# EasyEDA Pro project 立创地文星CW32F030C8T6开发板.epro

# Schematic F030
Board Name: CW32F030C8T6; Create Date: 2024-04-28; Page Name: P1; Project Name: 【CW32】开发板; Schematic Name: F030; Update Date: 2024-05-09; Company: 嘉立创EDA; Page Size: A4; Reviewed: 嘉立创EDA
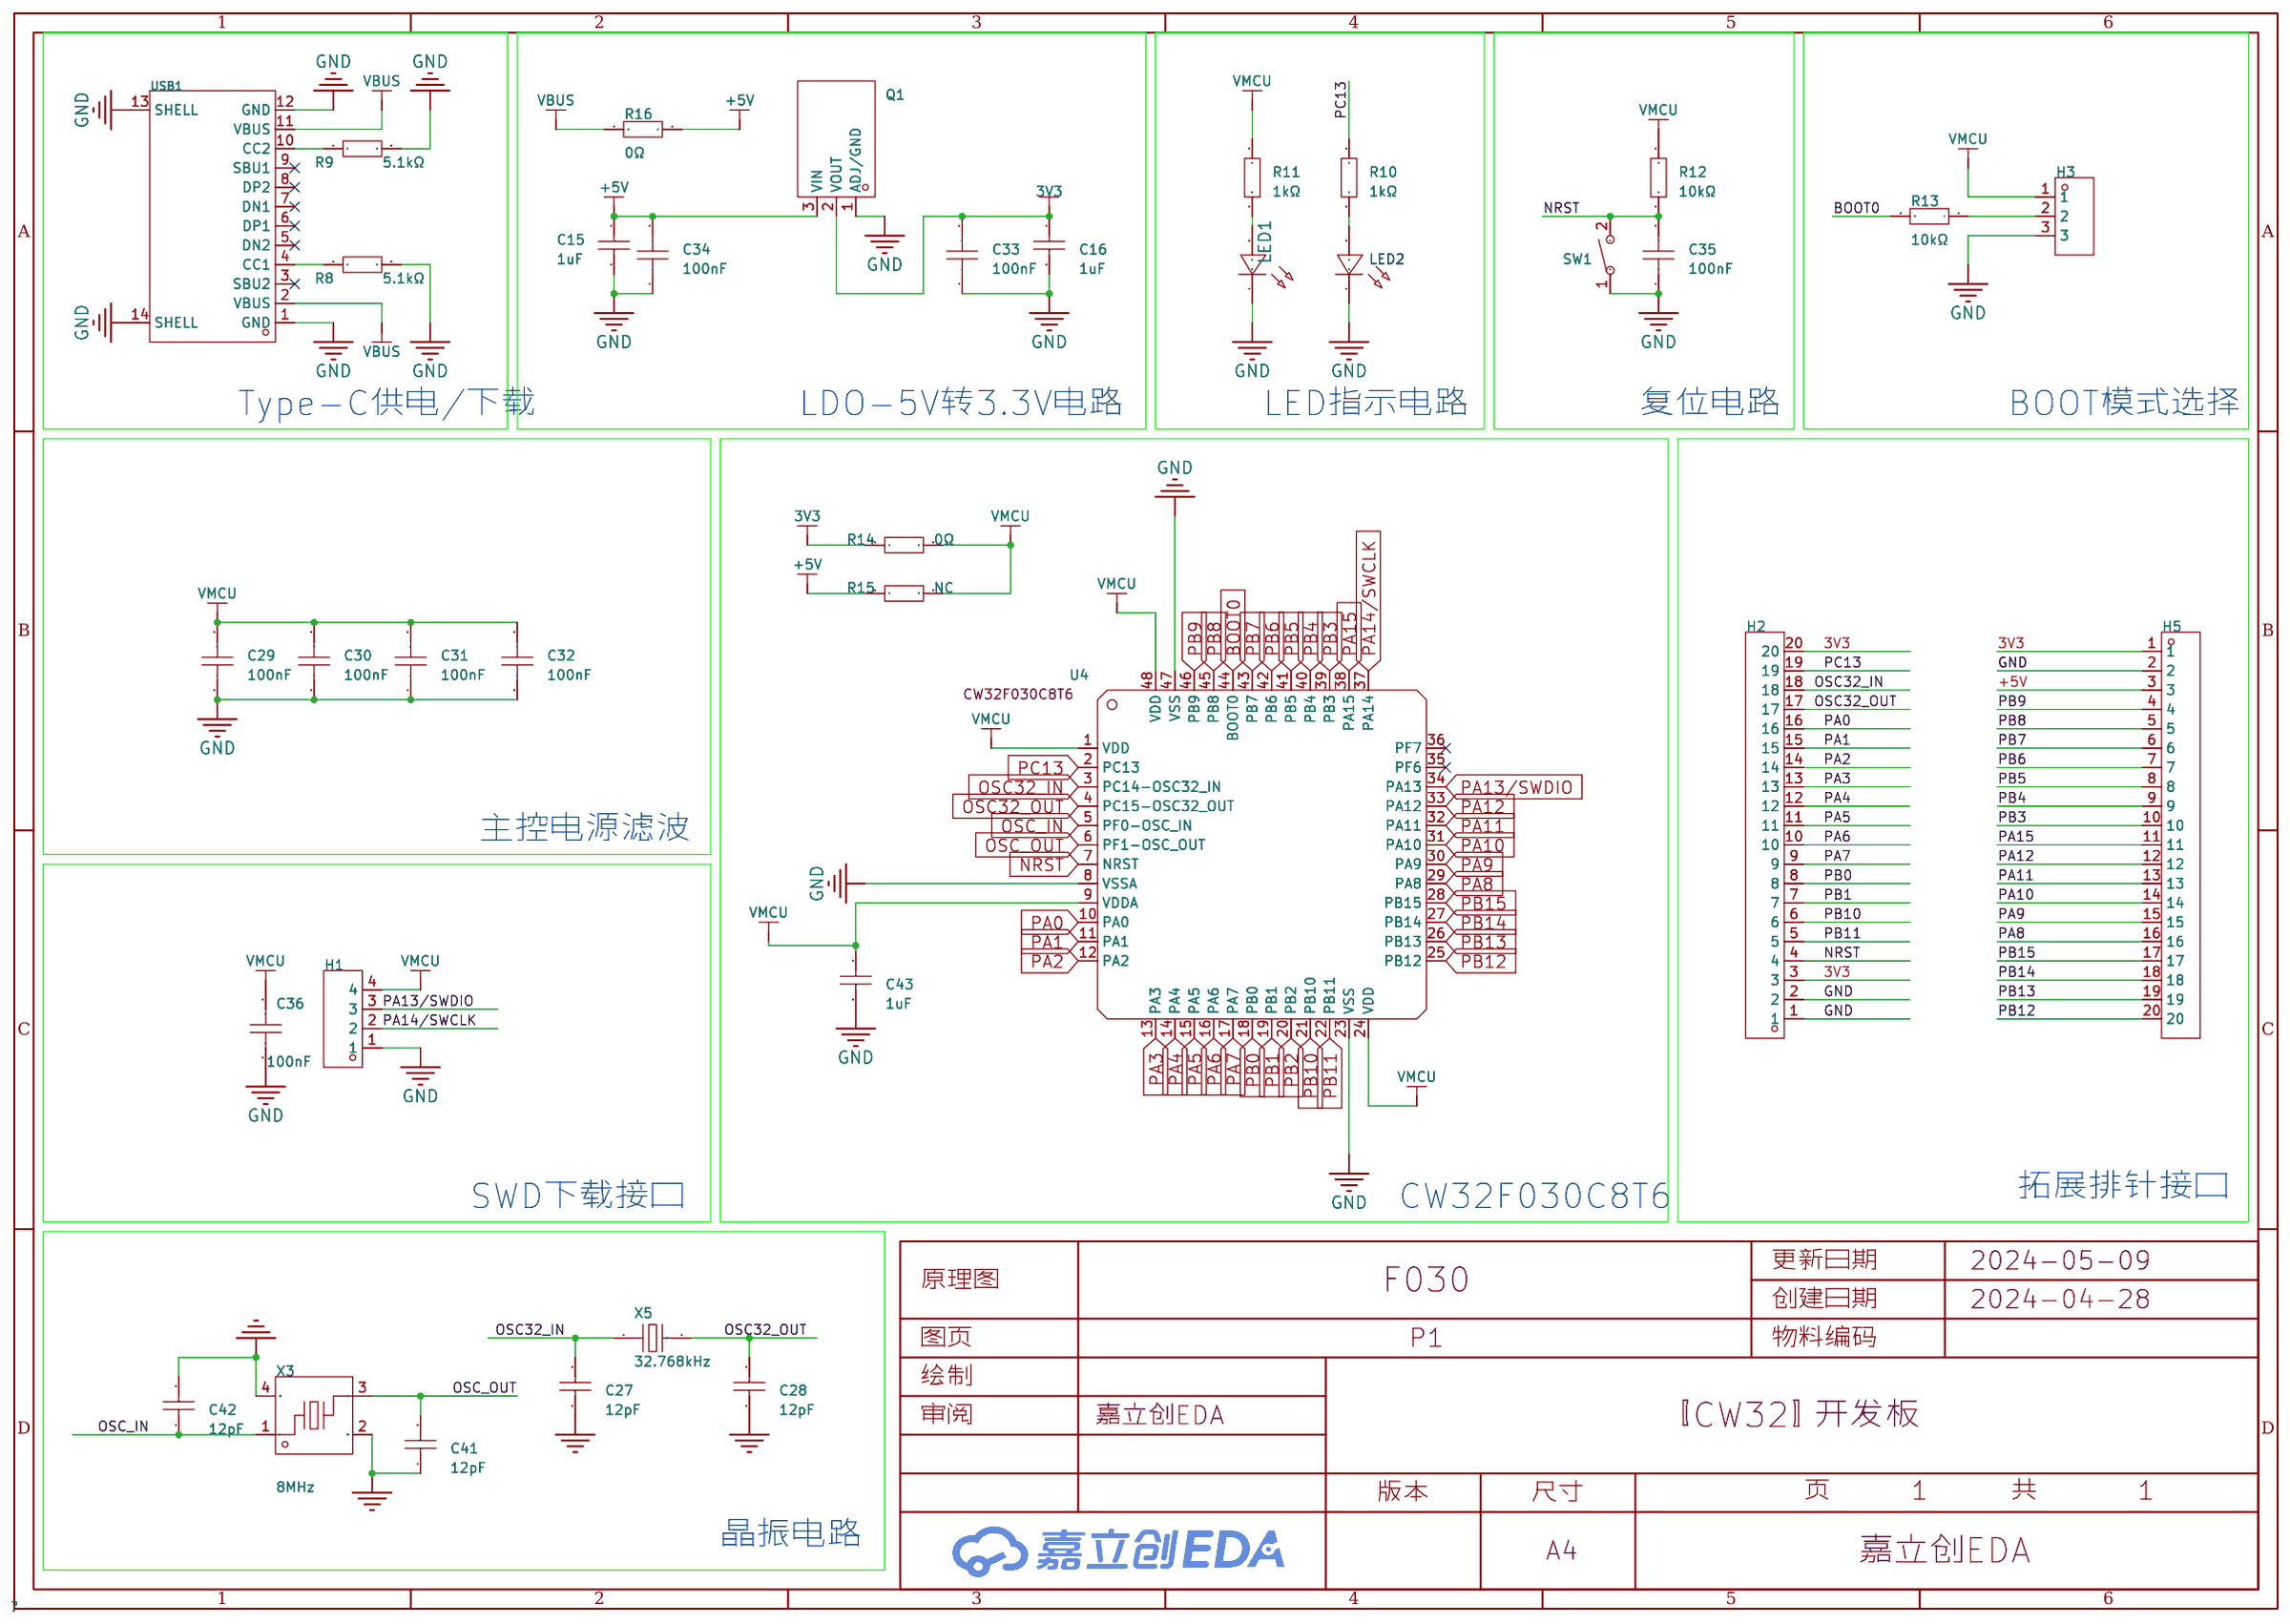
[diagram p0: schematic sheet]

## Parts
C15  1uF  [C0603]
C16  1uF  [R0402]
C27  12pF  [R0402]
C28  12pF  [R0402]
C29  100nF  [R0402]
C30  100nF  [R0402]
C31  100nF  [R0402]
C32  100nF  [R0402]
C33  100nF  [R0402]
C34  100nF  [C0603]
C35  100nF  [R0402]
C36  100nF  [R0402]
C41  12pF  [R0402]
C42  12pF  [R0402]
C43  1uF  [R0402]
H1  -  [HDR-TH_4P-P2.54-V-M]
H2  -  [HDR-TH_20P-P2.54-V-M-1]
H3  -  [HDR-TH_3P-P2.54-V-M]
H5  -  [HDR-TH_20P-P2.54-V-M-1]
LED1  -  [LED_0603]
LED2  -  [LED_0603]
Q1  AMS1117-3.3V  [SOT-89-3_L4.5-W2.5-P1.50-LS4.2-BR]
R8  5.1kΩ  [R0402]
R9  5.1kΩ  [R0402]
R10  1kΩ  [R0402]
R11  1kΩ  [R0402]
R12  10kΩ  [R0402]
R13  10kΩ  [R0402]
R14  0Ω  [R0805]
R15  NC  [R0805]
R16  0Ω  [R0603]
SW1  TS-1101-B-W  [KEY-SMD_2P-L6.0-W3.6-P7.4-LS8.0-L]
U4  CW32F030C8T6  [LQFP-48_L7.0-W7.0-P0.50-LS9.0-TL]
USB1  TYPE-C 16PIN 2MD(073)  [USB-C-SMD_TYPE-C-6PIN-2MD-073]
X3  8MHz  [CRYSTAL-SMD_4P-L3.2-W2.5-BL-1]
X5  32.768kHz  [OSC-SMD_L3.2-W1.5]

## Library data of the parts
C15 = CL10A105KO8NNNC: 容值:1uF;精度:±10%;额定电压:16V;材质(温度系数):X5R;; LCSC Part Name: 1uF ±10% 16V; Supplier Part: C1592; Manufacturer: SAMSUNG(三星); Supplier Footprint: 0603; JLCPCB Part Class: Extended Part; Datasheet: https://atta.szlcsc.com/upload/public/pdf/source/20220919/9FBE606BE0D9532D730F292EB26DC5BB.pdf; Supplier: LCSC; Tolerance: ±10%; Voltage Rated: 16V; Temperature Coefficient: X5R
C16 C43 = CL05A105KP5NNNC: 容值:1uF;精度:±10%;额定电压:10V;材质(温度系数):X5R;; LCSC Part Name: 1uF ±10% 10V; Supplier Part: C14445; Manufacturer: SAMSUNG(三星); Supplier Footprint: 0402; JLCPCB Part Class: 扩展库; Datasheet: https://atta.szlcsc.com/upload/public/pdf/source/20160218/1457707763339.pdf; Supplier: LCSC; Tolerance: ±10%; Voltage Rated: 10V; Temperature Coefficient: X5R
C27 C28 C41 C42 = 0402CG120J500NT: 容值:12pF;精度:±5%;额定电压:50V;材质(温度系数):C0G;; LCSC Part Name: 12pF ±5% 50V; Supplier Part: C1547; Manufacturer: FH(风华); Supplier Footprint: 0402; JLCPCB Part Class: 基础库; Datasheet: https://atta.szlcsc.com/upload/public/pdf/source/20200305/C486355_26A10D38EF8C2A5C37091D0039909270.pdf; Supplier: LCSC; Tolerance: ±5%; Voltage Rated: 50V; Temperature Coefficient: C0G
C29-C33 C35 C36 = GRM155R71H104KE14D: LCSC Part Name: 100nF ±10% 50V; Supplier Part: C77020; Manufacturer: muRata(村田); Supplier Footprint: 0402; JLCPCB Part Class: 扩展库; Datasheet: https://atta.szlcsc.com/upload/public/pdf/source/20180326/C77020_39BD49C951FF1AF0DB1F1FAC5AC1E401.pdf; Supplier: LCSC; Tolerance: ±10%; Voltage Rated: 50V; Temperature Coefficient: X7R
C34 = CC0603KRX7R9BB104: 容值:100nF;精度:±10%;额定电压:50V;材质(温度系数):X7R;; LCSC Part Name: 100nF ±10% 50V; Supplier Part: C14663; Manufacturer: YAGEO(国巨); Supplier Footprint: 0603; JLCPCB Part Class: Basic Part; Datasheet: https://atta.szlcsc.com/upload/public/pdf/source/20180910/C282072_33301C7F631E79921B82A8DAC6BCC5B3.pdf; Supplier: LCSC; Tolerance: ±10%; Voltage Rated: 50V; Temperature Coefficient: X7R
H1 = HDR-M_2.54_1x4P: Supplier Part: C2935929; Supplier Footprint: 插件
H2 H5 = HDR-M_2.54_1x20P: 间距:2.54mm;总PIN位数:20;排数:1;插针结构:-;行距:-;安装类型:直插;圆针/方针:-;额定电流:-;额定电压:-;配合针长度:-;塑高:-;触头材质:黄铜;触头镀层:-;颜色:黑色;; Supplier Part: C50981; Supplier Footprint: 插件
H3 = HDR-M_2.54_1x3P: Supplier Part: C2937625; Supplier Footprint: 插件
LED1 = LED_0603-R: Supplier Footprint: 0603; Supplier Part: C84263
LED2 = LED_0603-B: Supplier Footprint: 0603; Supplier Part: C84266
Q1 = AMS1117-3.3V_C5120796: LCSC Part Name: 输入18V 输出3.3V 1A; Supplier Part: C5120796; Manufacturer: MSKSEMI(美森科); Supplier Footprint: SOT-89; JLCPCB Part Class: 扩展库; Datasheet: https://atta.szlcsc.com/upload/public/pdf/source/20231123/6117526697EB8BF6175FDEEBA0877266.pdf; Supplier: LCSC; Output Type: 固定; Maximum Input Voltage: 18V; Output Voltage: 3.3V; MAX Output Current: 1A; Dropout Voltage: 1.4V@(1A); standby current: 12mA; Operating Temperature: 0℃~+125℃; Output Polarity: 正极; Number of Outputs: 1
R8 R9 = 0402WGF5101TCE: 电阻类型:厚膜电阻;阻值:5.1kΩ;精度:±1%;功率:62.5mW;最大工作电压:50V;温度系数:±100ppm/℃;; LCSC Part Name: 5.1kΩ ±1% 62.5mW 厚膜电阻; Supplier Part: C25905; Manufacturer: UNI-ROYAL(厚声); Supplier Footprint: 0402; JLCPCB Part Class: 基础库; Datasheet: https://atta.szlcsc.com/upload/public/pdf/source/20200306/C422600_1E6D84923E4A46A82E41ADD87F860B5C.pdf; Supplier: LCSC; Type: 厚膜电阻; Tolerance: ±1%; Power(Watts): 62.5mW; Overload Voltage (Max): 50V; Temperature Coefficient: ±100ppm/℃; Operating Temperature Range: -55℃~+155℃
R10 R11 = 0402WGF1001TCE: 电阻类型:厚膜电阻;阻值:1kΩ;精度:±1%;功率:62.5mW;最大工作电压:50V;温度系数:±100ppm/℃;; LCSC Part Name: 1kΩ ±1% 62.5mW 厚膜电阻; Supplier Part: C11702; Manufacturer: UNI-ROYAL(厚声); Supplier Footprint: 0402; JLCPCB Part Class: 基础库; Datasheet: https://atta.szlcsc.com/upload/public/pdf/source/20200306/C422600_1E6D84923E4A46A82E41ADD87F860B5C.pdf; Supplier: LCSC; Type: 厚膜电阻; Tolerance: ±1%; Power(Watts): 62.5mW; Overload Voltage (Max): 50V; Temperature Coefficient: ±100ppm/℃; Operating Temperature Range: -55℃~+155℃
R12 R13 = RC0402FR-0710KL: LCSC Part Name: 厚膜电阻 10kΩ ±1% 62.5mW; Supplier Part: C60490; Manufacturer: YAGEO(国巨); Supplier Footprint: 0402; JLCPCB Part Class: 扩展库; Datasheet: https://atta.szlcsc.com/upload/public/pdf/source/20170925/C131467_1506321478108990263.pdf; Supplier: LCSC; Type: 厚膜电阻; Tolerance: ±1%; Power(Watts): 62.5mW; Overload Voltage (Max): 50V; Temperature Coefficient: ±100ppm/℃; Operating Temperature Range: -55℃~+155℃
R14 R15 = 0805W8F0000T5E: LCSC Part Name: 0Ω ±1% 125mW 厚膜电阻; Supplier Part: C17477; Manufacturer: UNI-ROYAL(厚声); Supplier Footprint: 0805; JLCPCB Part Class: 基础库; Datasheet: https://atta.szlcsc.com/upload/public/pdf/source/20200306/C422600_1E6D84923E4A46A82E41ADD87F860B5C.pdf; Supplier: LCSC; Type: 厚膜电阻; Tolerance: ±1%; Power(Watts): 125mW; Overload Voltage (Max): 150V; Temperature Coefficient: ±800ppm/℃; Operating Temperature Range: -55℃~+155℃
R16 = 0603WAF0000T5E: LCSC Part Name: 0Ω ±1% 100mW 厚膜电阻; Supplier Part: C21189; Manufacturer: UNI-ROYAL(厚声); Supplier Footprint: 0603; JLCPCB Part Class: 基础库; Datasheet: https://atta.szlcsc.com/upload/public/pdf/source/20200306/C422600_1E6D84923E4A46A82E41ADD87F860B5C.pdf; Supplier: LCSC; Type: 厚膜电阻; Tolerance: ±1%; Power(Watts): 100mW; Overload Voltage (Max): 75V; Operating Temperature Range: -55℃~+155℃
SW1 = TS-1101-B-W_C500065: 触点电流:50mA;额定电压(DC):12V;绝缘电阻:-;电路结构:单刀单掷;安装方式:立贴;带灯:无;作用力:160gf;机械寿命:5万次;带支架:否;; LCSC Part Name: 6*3.6*2.5mm 立贴 轻触开关; Supplier Part: C500065; Manufacturer: XKB Connectivity(中国星坤); Supplier Footprint: SMD; JLCPCB Part Class: 扩展库; Datasheet: https://atta.szlcsc.com/upload/public/pdf/source/20211011/D0E0CAF534F7B19DDE4CE68748A25BD3.pdf; Supplier: LCSC; Contact Current: 50mA; Voltage Rating (DC): 12V; Circuit: 单刀单掷; Mounting Style: 立贴; Actuator Style: 矩形按钮; Actuator/Cap Color: 白色; With Lamp: 无; Operating Force: 160gf; Mechanical Life: 5万次; Operating Temperature: -30℃~+85℃; Switch Length: 6mm; Switch Width: 3.6mm; Switch Height: 2.5mm; Strike Gundam: 否
U4 = CW32F030C8T6_C3019113: Supplier Part: C3019113; Manufacturer: CW(芯源); Supplier Footprint: LQFP-48(7x7); JLCPCB Part Class: 扩展库; Datasheet: https://atta.szlcsc.com/upload/public/pdf/source/20220516/D60F5E1023A73FFF550D4A77416DDFBC.pdf; Supplier: LCSC; CPU Core: ARM-M系列; RAM Size: 8KB; GPIO Ports Number: 39; Operating Voltage Range: 1.65V~5.5V; CPU Maximum Speed: 64MHz; Operating Temperature Range: -40℃~+105℃; ADC (Bit): 12bit; 16Bit Timer: 8; UART/USART: 3; I2C: 2; SPI: 2; Internal Comparator: 有; Peripheral/Function: 片载温度传感器；DMA；看门狗；低电压检测；CRC校验; Watchdog: 有; Low-Voltage Detect: 有; Direct Memory Access: 有
USB1 = TYPE-C 16PIN 2MD(073): 连接器类型:Type-C;标准:-;公母:母座;触点数量:16;端口数量:1;安装方式:卧贴;额定电流 - 电源:5A;工作温度范围:-25℃~+85℃;; LCSC Part Name: TYPE-C母座 16P 4脚插件带定位柱 不锈钢外壳 2次模顶; Supplier Part: C2765186; Manufacturer: SHOU HAN(首韩); Supplier Footprint: SMD; JLCPCB Part Class: 扩展库; Supplier: LCSC; Connector Type: Type-C; Gender: 母座; Number of Contacts: 16; Number of Ports: 1; Mounting Style: 卧贴; Current Rating - Power (Max): 5A; Operating Temperature Range: -25℃~+85℃
X3 = XL2EL89COI-111YLC-8M: 晶振类型:贴片晶振;频率:8MHz;常温频差:±10ppm;外接负载电容:12pF;频率稳定度(全温):±20ppm;; LCSC Part Name: 8MHz ±10ppm 12pF; Supplier Part: C2973805; Manufacturer: YXC(扬兴晶振); Supplier Footprint: SMD3225-4P; JLCPCB Part Class: 扩展库; Datasheet: https://atta.szlcsc.com/upload/public/pdf/source/20240329/19D5F850207469550BEB00D7DFEDBC7A.pdf; Supplier: LCSC; Crystal Type: 贴片晶振; Normal temperature Frequency Tolerance: ±10ppm; External load capacitor: 12pF; Frequency Stability(Full temperature range): ±20ppm; Equivalent Series Resistance (ESR): 150Ω; Operating Temperature: -40℃~+85℃
X5 = X321532768KGD2SI: 晶振类型:贴片晶振;频率:32.768kHz;常温频差:±20ppm;外接负载电容:12.5pF;频率稳定度(全温):-;; LCSC Part Name: 32.768kHz ±20ppm 12.5pF; Supplier Part: C620155; Manufacturer: YXC(扬兴晶振); Supplier Footprint: SMD3215-2P; JLCPCB Part Class: 扩展库; Datasheet: https://atta.szlcsc.com/upload/public/pdf/source/20240329/3A7650FD985DD0DE85694D3785AB4916.pdf; Supplier: LCSC; Crystal Type: 贴片晶振; Normal temperature Frequency Tolerance: ±20ppm; External load capacitor: 12.5pF; Operating Temperature: -40℃~+85℃

## Nets
3V3: C16.2 C33.2 H2.3 H2.20 H5.1 Q1.2(VOUT) R14.1
+5V: C15.2 C34.2 H5.3 Q1.3(VIN) R15.1 R16.2
GND: C15.1 C16.1 C27.1 C28.1 C29.1 C30.1 C31.1 C32.1 C33.1 C34.1 C35.1 C36.1 C41.1 C42.2 C43.1 H1.1 H2.1 H2.2 H3.3 H5.2 LED1.1(C) LED2.1(C) Q1.1(ADJ/GND) R8.2 R9.2 SW1.1 U4.8(VSSA) U4.23(VSS) U4.47(VSS) USB1.1(GND) USB1.12(GND) USB1.13(SHELL) USB1.14(SHELL) X3.2(GND) X3.4(GND)
VBUS: R16.1 USB1.2(VBUS) USB1.11(VBUS)
BOOT0: R13.2 U4.44(BOOT0)
NRST: C35.2 H2.4 R12.1 SW1.2 U4.7(NRST)
OSC32_IN: C27.2 H2.18 U4.3(PC14-OSC32_IN) X5.1
OSC32_OUT: C28.2 H2.17 U4.4(PC15-OSC32_OUT) X5.2
OSC_IN: C42.1 U4.5(PF0-OSC_IN) X3.1
OSC_OUT: C41.2 U4.6(PF1-OSC_OUT) X3.3
PA0: H2.16 U4.10(PA0)
PA1: H2.15 U4.11(PA1)
PA2: H2.14 U4.12(PA2)
PA3: H2.13 U4.13(PA3)
PA4: H2.12 U4.14(PA4)
PA5: H2.11 U4.15(PA5)
PA6: H2.10 U4.16(PA6)
PA7: H2.9 U4.17(PA7)
PA8: H5.16 U4.29(PA8)
PA9: H5.15 U4.30(PA9)
PA10: H5.14 U4.31(PA10)
PA11: H5.13 U4.32(PA11)
PA12: H5.12 U4.33(PA12)
PA13/SWDIO: H1.3 U4.34(PA13)
PA14/SWCLK: H1.2 U4.37(PA14)
PA15: H5.11 U4.38(PA15)
PB0: H2.8 U4.18(PB0)
PB1: H2.7 U4.19(PB1)
PB2: U4.20(PB2)
PB3: H5.10 U4.39(PB3)
PB4: H5.9 U4.40(PB4)
PB5: H5.8 U4.41(PB5)
PB6: H5.7 U4.42(PB6)
PB7: H5.6 U4.43(PB7)
PB8: H5.5 U4.45(PB8)
PB9: H5.4 U4.46(PB9)
PB10: H2.6 U4.21(PB10)
PB11: H2.5 U4.22(PB11)
PB12: H5.20 U4.25(PB12)
PB13: H5.19 U4.26(PB13)
PB14: H5.18 U4.27(PB14)
PB15: H5.17 U4.28(PB15)
PC13: H2.19 R10.2 U4.2(PC13)
VMCU: C29.2 C30.2 C31.2 C32.2 C36.2 C43.2 H1.4 H3.1 R11.1 R12.2 R14.2 R15.2 U4.1(VDD) U4.9(VDDA) U4.24(VDD) U4.48(VDD)
$1N2054: R9.1 USB1.10(CC2)
$1N2066: R8.1 USB1.4(CC1)
$1N2074: LED1.2(A) R11.2
$1N2077: LED2.2(A) R10.1
$1N3104: H3.2 R13.1

Not connected (* = marked no-connect by the designer): U4 35(PF6)* 36(PF7)*; USB1 3(SBU2)* 5(DN2)* 6(DP1)* 7(DN1)* 8(DP2)* 9(SBU1)*

## Notes on the sheet
- Type-C供电/下载
- LDO-5V转3.3V电路
- LED指示电路
- 复位电路
- BOOT模式选择
- 主控电源滤波
- SWD下载接口
- CW32F030C8T6
- 拓展排针接口
- 晶振电路

# Board PCB1_1
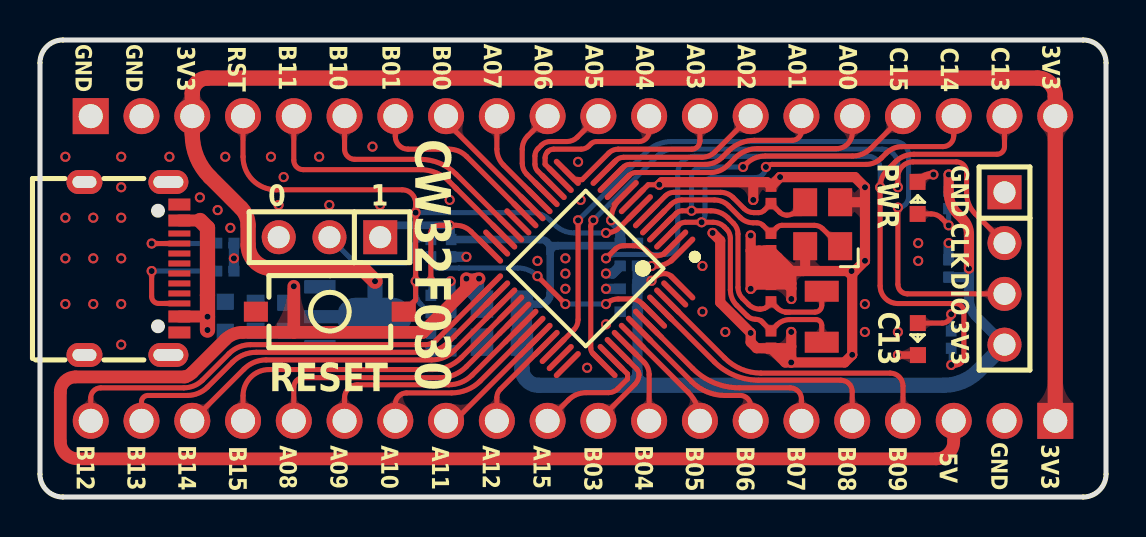
[diagram p1: board, top side]
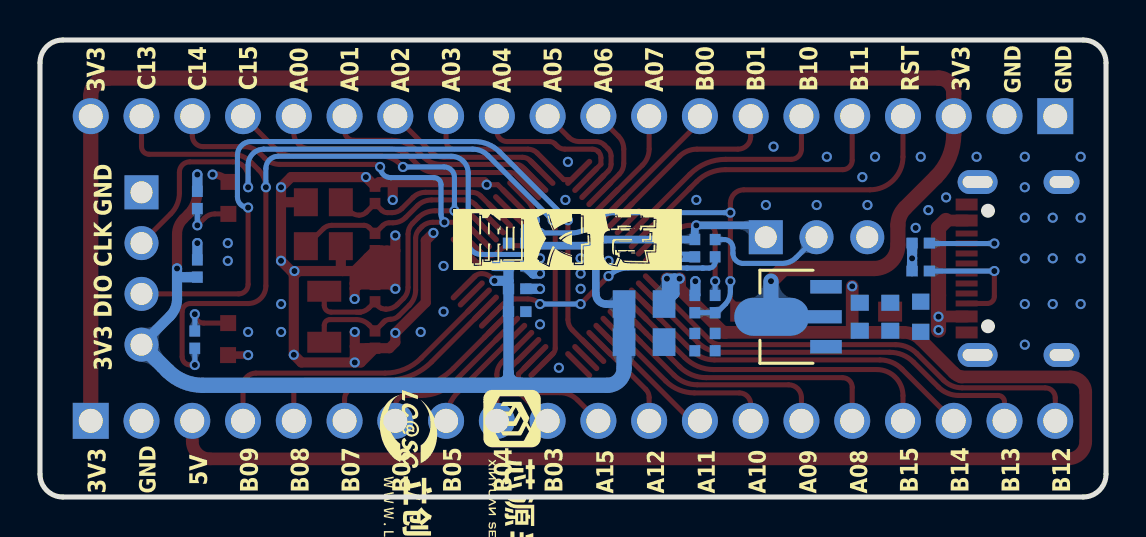
[diagram p2: board, bottom side, seen from below]

Outline 53.34 x 22.86 mm; copper layers: Top Layer, Bottom Layer. Coordinates in mm from the lower left corner of the outline.
Outline path: 0,21.72 0,1.14 arc(0.33,0.33) 1.14,0 52.2,0 arc(53.01,0.33) 53.34,1.14 53.34,21.72 arc(53.01,22.53) 52.2,22.86 1.14,22.86 arc(0.33,22.53) 0,21.72
Stack: Top Layer 0.035mm - / Dielectric1 1.51mm FR4 er 4.5 / Bottom Layer 0.035mm -

## Design rules (mm)
template: 自定义配置
spacing copperThickness1oz (default): track to track 0.102, other pairs 0.152 to 0.3
spacing copperThickness2oz: track to track 0.203, other pairs 0.152 to 0.3
track width copperThickness1oz (default): min 0.254, default 0.254, max 2.54
track width copperThickness2oz: min 0.203, default 0.254, max 2.54
differential pair differentialPair (default): width min 0.127, default 0.254, max 2.54; gap min 0.152, default 0.152
via viaSize (default): diameter min 0.508, default 0.508, max 0.508; hole min 0.305, default 0.305, max 0.305

## Placement (name value [footprint] x y rotation side)
C15  1uF  [c0603]  10.79 9.02 90 bottom
C16  1uF  [r0402]  20.57 7.75 90 bottom
C27  12pF  [r0402]  36.58 7.88 90 top
C28  12pF  [r0402]  36.58 10.2 270 top
C29  100nF  [r0402]  20.57 12.45 90 bottom
C30  100nF  [r0402]  29.46 11.56 0 bottom
C31  100nF  [r0402]  29.46 10.41 0 bottom
C32  100nF  [r0402]  29.46 12.7 180 bottom
C33  100nF  [r0402]  19.56 7.75 90 bottom
C34  100nF  [c0603]  12.32 9.02 90 bottom
C35  100nF  [r0402]  20.57 9.65 270 bottom
C36  100nF  [r0402]  45.47 11.43 270 bottom
C41  12pF  [r0402]  36.58 15.11 270 top
C42  12pF  [r0402]  36.58 12.76 270 top
C43  1uF  [r0402]  29.46 9.27 0 bottom
H1  -  [HDR-TH_4P-P2.54-V-M]  48.26 11.43 270 top
H2  -  [HDR-TH_20P-P2.54-V-M-1]  26.67 19.05 0 top
H3  -  [HDR-TH_3P-P2.54-V-M]  14.49 12.99 180 top
H5  -  [HDR-TH_20P-P2.54-V-M-1]  26.67 3.81 180 top
LED1  -  [led_0603]  43.92 14.91 270 top
LED2  -  [led_0603]  43.92 7.95 90 top
Q1  AMS1117-3.3V  [SOT-89-3_L4.5-W2.5-P1.50-LS4.2-BR]  15.37 9.02 180 bottom
R8  5.1kΩ  [r0402]  9.27 12.7 0 bottom
R9  5.1kΩ  [r0402]  9.27 11.3 0 bottom
R10  1kΩ  [r0402]  45.59 7.87 270 bottom
R11  1kΩ  [r0402]  45.47 14.86 270 bottom
R12  10kΩ  [r0402]  19.56 9.65 90 bottom
R13  10kΩ  [r0402]  19.56 12.45 270 bottom
R14  0Ω  [r0805]  23.11 7.75 0 bottom
R15  NC  [r0805]  23.11 9.65 0 bottom
R16  0Ω  [r0603]  9.27 9.02 90 bottom
SW1  TS-1101-B-W  [KEY-SMD_2P-L6.0-W3.6-P7.4-LS8.0-L]  14.5 9.27 0 top
U4  CW32F030C8T6  [LQFP-48_L7.0-W7.0-P0.50-LS9.0-TL]  27.31 11.43 225 top
USB1  TYPE-C 16PIN 2MD(073)  [USB-C-SMD_TYPE-C-6PIN-2MD-073]  4.6 11.43 270 top
X3  8MHz  [crystal-smd_4p-l3.2-w2.5-bl-1]  39.16 13.64 90 top
X5  32.768kHz  [osc-smd_l3.2-w1.5]  39.12 9.02 90 top

## Footprints (pads in the part's own frame, mm; a bottom-side part is the same pattern mirrored in y, then rotated)
c0603
  rect 0.8x0.9 smd: 1(-0.7,0) 2(0.7,0)
crystal-smd_4p-l3.2-w2.5-bl-1
  rect 1.4x1.2 smd: 1(-1.1,-0.875) 2(1.1,-0.875) 3(1.1,0.875) 4(-1.1,0.875)
HDR-TH_3P-P2.54-V-M
  rect 1.7x1.7 hole 1.1: 1(-2.54,0)
  round 1.7 hole 1.1: 2(0,0) 3(2.54,0)
HDR-TH_4P-P2.54-V-M
  rect 1.7x1.7 hole 1.1: 1(-3.81,0)
  round 1.7 hole 1.1: 2(-1.27,0) 3(1.27,0) 4(3.81,0)
HDR-TH_20P-P2.54-V-M-1
  rect 1.8x1.8 hole 1.2: 1(-24.13,0)
  round 1.8 hole 1.2: 2(-21.59,0) 3(-19.05,0) 4(-16.51,0) 5(-13.97,0) 6(-11.43,0) 7(-8.89,0) 8(-6.35,0) 9(-3.81,0) 10(-1.27,0) 11(1.27,0) 12(3.81,0) 13(6.35,0) 14(8.89,0) 15(11.43,0) 16(13.97,0) 17(16.51,0) 18(19.05,0) 19(21.59,0) 20(24.13,0)
KEY-SMD_2P-L6.0-W3.6-P7.4-LS8.0-L
  rect 1.2x1 smd: 1(-3.7,0) 2(3.7,0)
led_0603
  rect 0.8x0.8 smd: 1(-0.851,-0.01) 2(0.75,-0.005)
LQFP-48_L7.0-W7.0-P0.50-LS9.0-TL
  oval 1.8x0.28 smd: 1(-4.05,2.75) 2(-4.05,2.25) 3(-4.05,1.75) 4(-4.05,1.25) 5(-4.05,0.75) 6(-4.05,0.25) 7(-4.05,-0.25) 8(-4.05,-0.75) 9(-4.05,-1.25) 10(-4.05,-1.75) 11(-4.05,-2.25) 12(-4.05,-2.75) 25(4.05,-2.75) 26(4.05,-2.25) 27(4.05,-1.75) 28(4.05,-1.25) 29(4.05,-0.75) 30(4.05,-0.25) 31(4.05,0.25) 32(4.05,0.75) 33(4.05,1.25) 34(4.05,1.75) 35(4.05,2.25) 36(4.05,2.75)
  oval 0.28x1.8 smd: 13(-2.75,-4.05) 14(-2.25,-4.05) 15(-1.75,-4.05) 16(-1.25,-4.05) 17(-0.75,-4.05) 18(-0.25,-4.05) 19(0.25,-4.05) 20(0.75,-4.05) 21(1.25,-4.05) 22(1.75,-4.05) 23(2.25,-4.05) 24(2.75,-4.05) 37(2.75,4.05) 38(2.25,4.05) 39(1.75,4.05) 40(1.25,4.05) 41(0.75,4.05) 42(0.25,4.05) 43(-0.25,4.05) 44(-0.75,4.05) 45(-1.25,4.05) 46(-1.75,4.05) 47(-2.25,4.05) 48(-2.75,4.05)
osc-smd_l3.2-w1.5
  rect 1.05x1.7 smd: 1(-1.275,0) 2(1.275,0)
r0402
  rect 0.566x0.54 smd: 1(-0.433,0) 2(0.433,0)
r0603
  rect 0.806x0.864 smd: 1(-0.753,0) 2(0.753,0)
r0805
  rect 1.133x1.377 smd: 1(-1,0) 2(1,0)
SOT-89-3_L4.5-W2.5-P1.50-LS4.2-BR
  rect 1.575x0.672 smd: 1(1.356,-1.5) 3(1.356,1.5)
  custom 5.377x1.9 smd: 2(-1.356,0)
USB-C-SMD_TYPE-C-6PIN-2MD-073
  rect 0.6x1.1 smd: 1(-3.2,2.375) 2(-2.4,2.375) 11(2.4,2.375) 12(3.2,2.375)
  rect 0.3x1.1 smd: 3(-1.75,2.375) 4(-1.25,2.375) 5(-0.75,2.375) 6(-0.25,2.375) 7(0.25,2.375) 8(0.75,2.375) 9(1.25,2.375) 10(1.75,2.375)
  oval 1.2x2 hole 0.6x1.5: 13(-4.325,1.825) 14(4.325,1.825)
  oval 1.2x1.8 hole 0.6x1.2: 13(-4.325,-2.375) 14(4.325,-2.375)

## Nets
As in the schematic.

Pads without a net: U4 35 36; USB1 3 5 6 7 8 9

## Via types
v1: diameter 0.508, hole 0.305, Top Layer to Bottom Layer, 98 vias

## Routing (per net, layer and track width the routed paths; a pad name or vN(x,y) marks a point on that pad's centre or on a via; arc(x,y) is an arc through that point)
3V3: length 78
  Top Layer w0.762: v1(16.76,10.8) 16.13,11.43 11.6,11.43 arc(10.76,11.78) 10.41,12.62 10.41,13.59 arc(10.32,14.06) 10.06,14.46 8.51,16 arc(7.85,16.99) 7.62,18.15 H2.3 7.62,20.19 arc(7.84,20.73) 8.38,20.95 49.91,20.95 arc(50.54,20.69) 50.8,20.07 H2.20 H5.1
  Bottom Layer w0.762: v1(16.76,10.8) 16.76,9.06 arc(16.75,9.03) 16.72,9.02
+5V: length 79.1
  Top Layer w0.508: v1(21.34,10.92) v1(21.97,10.92)
  Top Layer w0.635: v1(12.7,10.54) 12.7,8.24 ; 12.7,8.24 10.15,8.24 arc(9.67,8.14) 9.27,7.87 7.62,6.22 arc(7.46,6.1) 7.27,6.01 arc(7.24,6.01) 7.2,6.01 1.78,6.01 arc(1.24,5.78) 1.02,5.25 1.02,2.79 arc(1.28,2.17) 1.9,1.91 44.83,1.91 arc(45.46,2.17) 45.72,2.79 H5.3 ; 12.7,8.24 19.04,8.24 19.04,8.24 19.16,8.24 21.34,10.41 ; 21.34,10.41 v1(21.34,10.92) ; 21.34,10.41 21.75,10.83 arc(21.85,10.9) v1(21.97,10.92)
  Bottom Layer w0.508: 21.84,9.92 21.97,10.05 v1(21.97,10.92) 21.59,10.92 ; 21.84,9.92 R15.1 ; 21.84,9.92 21.59,10.17 21.59,10.92 ; 21.59,10.92 v1(21.34,10.92)
GND: length 67.5
  Top Layer w0.254: 29.78,14.97 30.44,15.62 v1(30.99,15.62)
  Top Layer w0.381: 43.91,15.76 43.98,15.83 arc(44.31,16.05) v1(44.7,16.13) ; 43.93,7.1 v1(42.93,7.1)
  Top Layer w0.508: 37.39,10.63 37.12,10.9 36.85,10.9 ; 37.39,10.63 C28.1 ; 37.39,10.63 37.6,10.43 ; 37.6,11.3 37.6,10.68 ; 37.6,11.3 37.25,11.3 37.11,11.16 ; 37.6,11.3 36.92,11.98 ; 37.6,11.3 38.2,11.3 ; 37.6,10.68 37.6,10.43 ; 37.6,10.68 37.11,11.16 ; C28.1 C42.2 ; C28.1 35.78,10.63 ; C28.1 36.85,10.9 ; C42.2 36.92,11.98 ; C42.2 36.24,12.32 ; 35.98,10.84 36.24,11.09 36.24,12.32 ; 35.98,10.84 35.78,10.63 ; 35.98,10.84 35.98,12.32 ; 40.4,11.3 38.2,11.3 ; 40.4,11.3 40.64,11.06 v1(40.64,7.11) 40.26,6.73 v1(37.59,6.73) ; 40.4,11.3 40.77,11.3 v1(41.28,11.82) 41.28,14.71 ; 38.2,11.3 38.29,11.39 X3.4 ; 35.78,10.63 v1(35.56,10.41) 35.56,12.32 ; C27.1 37.29,6.73 v1(37.59,6.73) ; C27.1 36.96,7.44 ; C27.1 35.86,7.44 35.56,7.74 v1(35.56,8.21) 34.04,9.73 34.04,12.83 v1(33.66,13.21) ; 36.92,11.98 36.92,11.03 36.95,11 ; 37.6,10.43 v1(37.6,9.91) ; 41.28,14.71 41.24,14.75 X3.2 ; 41.28,14.71 v1(41.28,15.49) 40.77,16 v1(37.03,16) C41.1 36.37,15.75 35.69,15.75 ; 35.69,15.75 31.12,15.75 v1(30.99,15.62) ; 35.69,15.75 v1(35.69,14.86) ; 37.11,11.16 36.95,11 ; 36.95,11 36.85,10.9 ; 37.59,7.54 v1(37.59,8.25) ; 37.59,7.54 37.59,6.97 ; 37.59,7.54 37.5,7.44 36.96,7.44 ; 36.96,7.44 37.43,6.97 37.59,6.97 ; v1(37.59,6.73) 37.59,6.97 ; 36.24,12.32 35.98,12.32 ; 35.98,12.32 35.56,12.32 ; 35.56,12.32 v1(35.56,13.08)
  Bottom Layer w0.508: C31.1 v1(28.32,10.41) ; C36.1 v1(45.47,12.7) ; v1(20.55,10.8) 20.55,10.11 20.57,10.08 ; v1(28.32,11.18) 28.65,11.18 C30.1 ; R8.2 v1(9.7,11.94) R9.2 ; C29.1 v1(21.34,12.01)
  vias: v1(1.27,17.02) v1(1.27,13.97) v1(1.27,11.94) v1(1.27,9.65) v1(2.67,13.97) v1(2.67,11.94) v1(2.67,9.65) v1(4.06,17.02) v1(4.06,15.49) v1(4.06,13.97) v1(4.06,11.94) v1(4.06,9.65) v1(4.06,7.62) v1(6.48,17.02) v1(8,14.99) v1(8.89,14.35) v1(9.27,17.02) v1(9.53,13.46) v1(11.56,17.02) v1(11.94,14.61) v1(12.19,16) v1(13.97,17.02) v1(14.48,14.61) v1(16.64,17.53) v1(17.02,14.61) v1(20.5,14.86) v1(24.89,11.81) v1(26.29,11.94) v1(26.29,11.18) v1(26.29,10.41) v1(26.92,16.76) v1(27.05,14.86) v1(27.38,6.46) v1(28.32,8.64) v1(33.15,11.56) v1(33.15,9.27) v1(34.29,8.25) v1(40.61,11.3) v1(41.28,9.65) v1(41.28,8.25) v1(42.93,8.25) v1(43.94,12.7) v1(43.94,11.81)
VBUS: length 8.3
  Top Layer w0.254: 8.38,10.09 8.13,10.09
  Top Layer w0.584: USB1.2 8.01,13.83 ; v1(8.38,9.02) 8.37,9.03 USB1.11
  Top Layer w0.762: 8.01,13.83 8.38,13.46 v1(8.38,9.02) v1(8.38,8.35)
BOOT0: length 12.7
  Top Layer w0.254: U4.44 30.1,9.69 arc(29.87,9.85) 29.59,9.91 28.93,9.91 arc(28.6,9.84) v1(28.32,9.65) ; v1(24.89,11.05) v1(26.29,9.65)
  Bottom Layer w0.254: 20.12,11.45 20.18,11.46 20.19,11.45 ; 20.19,11.45 19.87,11.45 arc(19.65,11.54) 19.56,11.76 R13.2 ; 20.19,11.45 20.96,11.45 20.96,11.46 23.91,11.46 arc(24.44,11.35) v1(24.89,11.05) ; v1(28.32,9.65) v1(26.29,9.65)
NRST: length 32.6
  Top Layer w0.254: H2.4 10.16,17.02 arc(10.64,15.85) 11.81,15.37 18.12,15.37 arc(18.6,15.17) 18.8,14.7 v1(18.8,14.22) v1(18.8,10.8) 18.8,9.86 SW1.2 ; U4.7 29.02,13.5 arc(28.7,13.28) v1(28.32,13.21)
  Bottom Layer w0.254: C35.2 R12.1 19.48,9.22 19.03,9.66 arc(18.86,9.96) 18.8,10.3 v1(18.8,10.8) ; v1(18.8,14.22) 24.61,14.22 arc(25.1,14.12) 25.53,13.84 25.75,13.62 arc(26.21,13.32) 26.75,13.21 v1(28.32,13.21)
OSC32_IN: length 29.7
  Top Layer w0.254: 31.55,13.2 31.95,13.6 arc(32.11,13.71) 32.28,13.74 v1(33.11,13.74) 33.68,13.74 arc(33.99,13.68) 34.24,13.51 34.36,13.39 arc(34.5,13.19) 34.54,12.94 34.54,10.36 arc(34.63,9.94) 34.87,9.58 35.39,9.06 arc(35.58,8.93) 35.8,8.89 arc(35.95,8.87) 36.08,8.81 ; 36.08,8.81 C27.2 36.85,8.59 arc(36.87,8.61) 36.89,8.63 arc(37.18,8.81) 37.52,8.88 38.83,8.88 arc(39.03,8.79) 39.12,8.59 X5.1 ; 36.08,8.81 arc(36.16,8.74) 36.22,8.66 ; H2.18 45.72,18.07 arc(45.56,17.68) 45.18,17.53 43.14,17.53 arc(42.71,17.44) 42.34,17.2 42.1,16.95 arc(41.75,16.72) 41.33,16.64 36.63,16.64 arc(36.46,16.6) v1(36.32,16.51)
  Bottom Layer w0.254: v1(36.32,16.51) arc(36.17,16.13) 35.79,15.98 33.63,15.98 arc(33.38,15.87) 33.27,15.62 33.27,14.15 arc(33.23,13.93) v1(33.11,13.74)
OSC32_OUT: length 27
  Top Layer w0.254: 31.19,13.55 31.83,14.19 arc(31.97,14.28) 32.14,14.32 v1(32.6,14.32) 33.57,14.32 arc(34.03,14.23) 34.42,13.96 34.71,13.68 arc(34.87,13.44) 34.93,13.15 34.93,10.49 arc(34.99,10.18) 35.16,9.93 35.46,9.63 arc(35.71,9.46) 36.01,9.4 36.04,9.4 arc(36.15,9.41) 36.25,9.44 arc(36.45,9.56) 36.58,9.77 36.88,9.46 arc(37.08,9.32) 37.31,9.25 ; 37.31,9.25 38.78,9.25 arc(39.02,9.35) 39.12,9.59 X5.2 ; 37.31,9.25 arc(37.41,9.24) 37.51,9.25 ; v1(35.18,16.51) 35.33,16.66 arc(35.77,16.95) 36.29,17.06 40.65,17.06 arc(41.15,17.15) 41.56,17.43 H2.17
  Bottom Layer w0.254: v1(32.6,14.32) 32.6,15.99 arc(32.75,16.36) 33.12,16.51 v1(35.18,16.51)
OSC_IN: length 10.7
  Top Layer w0.254: X3.1 39.16,13.42 arc(38.97,13.54) 38.75,13.59 37.12,13.59 arc(36.99,13.56) 36.87,13.48 C42.1 36.18,13.59 arc(36.03,13.68) 35.87,13.72 35.68,13.72 arc(35.33,13.79) 35.04,13.98 34.46,14.56 arc(34.13,14.78) 33.74,14.86 32.11,14.86 arc(31.82,14.8) 31.57,14.64 30.84,13.91
OSC_OUT: length 9.2
  Top Layer w0.254: 30.49,14.26 31.29,15.06 arc(31.49,15.19) 31.72,15.24 34.05,15.24 arc(34.39,15.17) 34.68,14.98 35.23,14.42 arc(35.45,14.28) 35.72,14.22 35.96,14.22 arc(36.11,14.25) 36.23,14.34 C41.2 37.01,14.25 arc(37.18,14.14) 37.37,14.1 arc(37.62,14.15) 37.83,14.29 X3.3
PA0: length 13.4
  Top Layer w0.254: 29.07,15.67 29.5,16.1 arc(29.64,16.2) 29.81,16.23 33.54,16.23 arc(34.01,16.32) 34.41,16.59 34.78,16.96 arc(35.3,17.3) 35.91,17.43 39.86,17.43 arc(40.41,17.65) 40.64,18.21 H2.16
PA1: length 11
  Top Layer w0.254: 28.72,16.03 29.2,16.51 arc(29.34,16.6) 29.51,16.64 33.29,16.64 arc(33.74,16.73) 34.13,16.99 34.45,17.3 arc(35.04,17.7) 35.74,17.84 37.63,17.84 arc(37.96,17.98) 38.1,18.31 H2.15
PA2: length 8.2
  Top Layer w0.254: H2.14 33.78,17.27 arc(33.47,17.06) 33.12,16.99 29.2,16.99 arc(29,16.95) 28.82,16.84 28.37,16.38
PA3: length 9.1
  Top Layer w0.254: H2.13 33.02,17.8 arc(32.9,17.52) 32.62,17.4 28.93,17.4 arc(28.67,17.35) 28.46,17.21 27.13,15.88 26.75,15.88 26.24,16.38
PA4: length 7.8
  Top Layer w0.254: 25.89,16.03 25.27,16.64 25.27,16.96 arc(25.31,17.13) 25.4,17.27 25.4,17.28 arc(25.54,17.37) 25.7,17.4 27.08,17.4 arc(27.29,17.44) 27.46,17.56 27.57,17.66 arc(27.7,17.75) 27.85,17.78 29.97,17.78 arc(30.33,17.93) 30.48,18.3 H2.12
PA5: length 5.7
  Top Layer w0.254: H2.11 26.88,18 arc(26.65,17.84) 26.37,17.78 25.53,17.78 arc(25.29,17.73) 25.09,17.6 24.91,17.42 arc(24.8,17.26) 24.76,17.06 24.76,16.64 arc(24.8,16.46) 24.9,16.31 25.54,15.67
PA6: length 4.6
  Top Layer w0.254: 25.18,15.32 24.35,16.15 arc(24.19,16.4) 24.13,16.69 24.13,17.4 arc(24.2,17.75) 24.4,18.05 H2.10
PA7: length 4.9
  Top Layer w0.254: H2.9 22.86,17.41 arc(22.95,16.97) 23.19,16.6 24.83,14.97
PA8: length 15.5
  Top Layer w0.254: 23.01,8.19 23.91,9.1 ; 23.01,8.19 21.33,6.52 arc(20.72,6.11) 20.01,5.97 13.18,5.97 arc(12.84,5.83) 12.7,5.49 H5.16 ; 23.01,8.19 23.77,8.95
PA9: length 13
  Top Layer w0.254: H5.15 15.24,4.97 arc(15.43,5.42) 15.88,5.61 20.45,5.61 arc(21.08,5.74) 21.62,6.1 23.29,7.76 ; 23.29,7.76 24.26,8.74 ; 23.29,7.76 24.12,8.6
PA10: length 9.2
  Top Layer w0.254: U4.31 22.03,5.8 arc(21.37,5.36) 20.59,5.21 18.35,5.21 arc(17.95,5.04) 17.78,4.64 H5.14
PA11: length 7.5
  Top Layer w0.254: H5.13 20.75,3.81 24.05,7.12 ; 24.83,7.89 24.05,7.12 ; 24.05,7.12 U4.32
PA12: length 4.9
  Top Layer w0.254: 25.32,7.68 23.03,5.39 arc(22.9,5.2) 22.86,4.97 H5.12
PA13/SWDIO: length 37.9
  Top Layer w0.254: H1.3 43.4,10.16 arc(43.07,10.3) 42.93,10.64 v1(42.93,14.48) ; v1(26.92,13.84) 26.92,8.88 arc(26.87,8.6) 26.71,8.36 U4.34
  Bottom Layer w0.254: v1(26.92,13.84) 30.34,17.26 arc(30.92,17.65) 31.59,17.78 42.78,17.78 arc(43.26,17.58) 43.46,17.1 43.46,15.01 arc(43.3,14.63) v1(42.93,14.48)
PA14/SWCLK: length 34.7
  Top Layer w0.254: H1.2 46.8,14.16 arc(46.48,14.64) 46.36,15.21 46.36,16.25 arc(46.21,16.61) 45.85,16.76 43.69,16.76 arc(43.15,16.54) 42.93,16 v1(42.93,15.49) ; U4.37 27.67,7.18 arc(27.59,7.3) 27.56,7.44 27.56,13.54 arc(27.59,13.7) v1(27.69,13.84)
  Bottom Layer w0.254: v1(27.69,13.84) 30.92,17.08 arc(31.28,17.32) 31.69,17.4 42.14,17.4 arc(42.7,17.17) 42.93,16.61 v1(42.93,15.49)
PA15: length 6
  Top Layer w0.254: H5.11 26.44,4.85 arc(26.85,5.13) 27.33,5.22 28.45,5.22 arc(28.7,5.27) 28.91,5.41 29.4,5.91 29.4,6.15 28.72,6.83
PB0: length 6.2
  Top Layer w0.254: H2.8 20.32,18.77 24.48,14.61
PB1: length 9
  Top Layer w0.254: H2.7 17.78,18.03 arc(17.97,17.58) 18.41,17.4 20.47,17.4 arc(20.94,17.3) 21.35,17.04 24.12,14.26
PB3: length 4.5
  Top Layer w0.254: 29.07,7.19 29.86,6.4 arc(29.94,6.28) 29.97,6.12 arc(29.92,5.86) 29.77,5.64 H5.10
PB4: length 4.1
  Top Layer w0.254: 29.43,7.54 30.22,6.74 arc(30.41,6.46) 30.48,6.12 H5.9
PB5: length 5.3
  Top Layer w0.254: 29.78,7.89 32.42,5.25 arc(32.86,4.59) H5.8
PB6: length 7.9
  Top Layer w0.254: H5.7 35.56,4.56 arc(35.41,4.93) 35.03,5.08 34.27,5.08 arc(33.38,5.26) 32.62,5.77 U4.42
PB7: length 11.3
  Top Layer w0.254: 30.49,8.6 31.1,7.99 ; 31.1,7.99 30.35,8.74 ; 31.1,7.99 32.66,6.42 arc(33.73,5.71) 34.99,5.46 37.54,5.46 arc(37.94,5.3) 38.1,4.9 H5.6
PB8: length 12.5
  Top Layer w0.254: 31.19,9.31 33.74,6.76 arc(34.76,6.08) 35.96,5.84 40.07,5.84 arc(40.47,5.68) 40.64,5.27 H5.5
PB9: length 15.1
  Top Layer w0.254: H5.4 43.18,5.56 arc(42.99,6.01) 42.54,6.2 36.07,6.2 arc(35.09,6.39) 34.26,6.95 31.55,9.66
PB10: length 11.4
  Top Layer w0.254: H2.6 15.24,17.4 arc(15.39,17.04) 15.75,16.89 19.03,16.89 arc(20,16.7) 20.82,16.15 23.42,13.55
PB11: length 14.2
  Top Layer w0.254: 20.86,15.4 20.48,15.78 arc(19.82,16.22) 19.04,16.37 13.17,16.37 arc(12.84,16.51) 12.7,16.84 H2.5 ; 20.86,15.4 23.06,13.2 ; 20.86,15.4 20.76,15.5
PB12: length 23.3
  Top Layer w0.254: 22.5,10.51 19.83,7.85 arc(19.58,7.68) 19.28,7.62 10.54,7.62 arc(9.95,7.5) 9.46,7.17 8.14,5.85 arc(7.71,5.56) 7.2,5.46 3.04,5.46 arc(2.69,5.31) 2.54,4.96 H5.20
PB13: length 20.8
  Top Layer w0.254: 22.85,10.16 20.43,7.74 arc(19.88,7.37) 19.22,7.24 10.82,7.24 arc(10.18,7.11) 9.63,6.75 8.38,5.5 arc(7.92,5.19) 7.37,5.08 5.4,5.08 arc(5.17,4.99) 5.08,4.76 H5.19
PB14: length 19
  Top Layer w0.254: H5.18 10.21,6.4 arc(10.72,6.74) 11.32,6.86 19.59,6.86 arc(20.21,6.98) 20.73,7.33 22.32,8.92 ; 22.32,8.92 U4.27 ; 22.32,8.92 23.06,9.66
PB15: length 16.6
  Top Layer w0.254: H5.17 10.16,5.07 arc(10.54,5.99) 11.47,6.38 19.63,6.38 arc(20.42,6.53) 21.08,6.98 U4.28
PC13: length 46
  Top Layer w0.254: v1(45.59,6.6) 45.82,6.6 arc(46.11,6.72) 46.23,7.02 46.23,9.27 arc(46.11,9.56) 45.82,9.68 42.92,9.68 arc(42.3,9.94) 42.04,10.56 v1(42.04,15.49) arc(42.13,15.96) 42.4,16.36 42.79,16.76 arc(43.22,17.04) 43.73,17.14 47.88,17.14 arc(48.15,17.26) 48.26,17.52 H2.19 ; 31.76,12.7 31.31,12.25 arc(31.1,12.11) 30.86,12.06 arc(30.63,12.11) 30.43,12.24 30.35,12.32 arc(30.07,12.51) 29.74,12.57 29.21,12.57 arc(28.98,12.53) 28.78,12.39 v1(28.32,11.94)
  Bottom Layer w0.254: v1(42.04,15.49) 42.04,16.44 arc(41.86,16.87) 41.43,17.04 32.76,17.04 arc(32.16,16.79) 31.91,16.19 31.91,12.78 arc(31.72,12.32) 31.27,12.13 28.79,12.13 arc(28.54,12.08) v1(28.32,11.94) ; v1(45.59,6.6) R10.2
VMCU: length 79.9
  Top Layer w0.254: 22.36,12.49 21.57,13.27 arc(21.22,13.51) 20.81,13.59 v1(20.5,13.59) 19.94,13.59 arc(19.67,13.48) 19.56,13.21 v1(19.56,10.8) ; v1(30.6,10.81) 30.76,10.97 arc(30.98,11.12) 31.24,11.18 arc(31.43,11.14) 31.59,11.03 32.11,10.51 ; 32.11,12.35 31.61,11.84 arc(31.14,11.6) v1(30.61,11.56) ; U4.9 29.02,14.91 arc(28.69,14.42) v1(28.57,13.84)
  Top Layer w0.508: v1(46.48,11.43) 46.48,13.15 arc(46.4,13.56) 46.17,13.9 45.92,14.15 arc(45.58,14.65) 45.47,15.25 v1(45.47,16.13)
  Bottom Layer w0.254: 19.56,10.08 v1(19.56,10.8)
  Bottom Layer w0.381: 25.91,12.57 25.53,12.57 ; 25.91,12.57 28.9,12.57 C32.2 ; 25.91,12.57 arc(25.64,12.46) 25.53,12.19 ; 25.53,12.19 25.53,10.16 arc(25.38,9.8) 25.02,9.65 R15.2 ; 25.53,12.19 25.53,12.4 arc(25.39,12.74) 25.04,12.88 C29.2 20.57,13.51 v1(20.5,13.59) 17.62,13.59 arc(17.2,13.41) H3.1
  Bottom Layer w0.508: 29.21,5.72 29.36,5.72 arc(29.74,5.87) 29.9,6.25 ; H1.4 46.84,9.04 arc(46.58,9.44) 46.48,9.91 46.48,10.97 ; v1(30.6,10.81) 29.9,10.81 ; 29.9,10.81 C31.2 C43.2 29.9,6.25 ; 29.9,10.81 C30.2 v1(30.61,11.56) ; R11.1 v1(45.47,16.13) ; 29.9,6.25 29.9,6.17 ; 46.48,10.97 v1(46.48,11.43) ; 46.48,10.97 46.45,11 C36.2 ; 29.9,6.17 29.9,5.72 ; 29.9,6.17 arc(30.03,5.85) 30.35,5.72 ; v1(28.57,13.84) 28.62,13.8 arc(28.79,13.67) 28.91,13.51 29.03,13.39 C32.2
  Bottom Layer w0.762: R14.2 24.11,6.44 arc(24.36,5.84) 24.96,5.59 45.21,5.59 arc(46.15,5.77) 46.95,6.31 H1.4
  Bottom Layer w1.016: R15.2 R14.2
$1N2054: length 6.1
  Top Layer w0.254: v1(5.59,11.3) 5.59,10.03 arc(5.69,9.78) 5.94,9.68 USB1.10
  Bottom Layer w0.254: v1(5.59,11.3) R9.1
$1N2066: length 4.7
  Top Layer w0.254: USB1.4 v1(5.59,12.68)
  Bottom Layer w0.254: 5.61,12.7 v1(5.59,12.68) 8.82,12.68 R8.1
$1N2074: length 2.6
  Top Layer w0.254: LED1.2 44.59,14.16 arc(44.87,14.1) 45.11,13.95 v1(45.47,13.59)
  Bottom Layer w0.254: v1(45.47,13.59) R11.2
$1N2077: length 2.8
  Top Layer w0.254: LED2.2 45.15,8.7 arc(45.46,8.83) v1(45.59,9.14)
  Bottom Layer w0.254: v1(45.59,9.14) R10.1
$1N3104: length 6.4
  Bottom Layer w0.254: R13.1 19.1,12.88 arc(18.8,12.75) 18.67,12.45 18.67,12.19 arc(18.52,11.83) 18.16,11.68 16.2,11.68 arc(15.83,11.76) 15.51,11.97 H3.2

## Copper pours and planes (outline as drawn; the poured copper is in the pictures)
3V3 on Bottom Layer: 19.51,8.78 18.29,10 16.62,10 16.26,9.63 16.26,8.51 17.02,7.75 20.67,7.75 21.41,7.01 22.88,7.01 23.11,7.24 23.11,8.55 22.88,8.78
+5V on Bottom Layer: 10.28,11.07 9.03,11.07 8.65,10.7 8.65,9.13 8.76,9.02 12.83,9.02 13.34,9.53 14.86,9.53 15.24,9.91 15.24,11.1 14.57,11.78 10.99,11.78
GND on Top Layer: -1.4,24.51 54.99,24.51 54.99,-1.65 -1.4,-1.65
GND on Bottom Layer: 20.85,7.74 15.55,7.74 15.04,8.24 13.51,8.24 12.75,9.01 10.54,9.01 10.25,8.72 10.25,7.71 9.65,7.11 8.13,7.11 7.11,8.13 5.72,8.13 5.33,7.75 5.33,5.71 5.96,5.08 20.07,5.08 21.08,6.1 21.08,7.5
GND on Bottom Layer: -1.02,24.13 54.23,24.13 54.23,-0.89 -1.02,-0.89
VBUS on Bottom Layer: 9.02,9.02 8.64,9.4 8,9.4 7.62,9.02 7.62,7.49 8,7.11 9.59,7.11 10,7.52 10,8.95 9.93,9.02

Small or netless copper shapes (teardrops, artwork), in the pictures only: 159 on Top Layer, 64 on Bottom Layer

## Text on the board
Bottom Silkscreen Layer: GND | A08 | A09 | A10 | A11 | A12 | A15 | B12 | B13 | 3V3 | B14 | RST | B15 | B11 | B10 | B01 | B00 | A07 | A06 | B03 | A05 | B04 | A04 | B05 | A03 | B06 | A02 | B07 | A01 | B08 | A00 | B09 | C15 | 5V | C14 | C13 | CLK | DIO
Top Silkscreen Layer: GND | A08 | A09 | A10 | A11 | A12 | A15 | 3V3 | B12 | B13 | B14 | RST | B15 | B11 | B10 | B01 | B00 | A07 | A06 | B03 | A05 | B04 | A04 | B05 | A03 | B06 | A02 | B07 | A01 | B08 | A00 | B09 | C15 | 5V | C14 | CLK | DIO | C13 | PWR | 0 | 1 | RESET | CW32F030
